# Altium schematic sheet K64.SchDoc
size A3
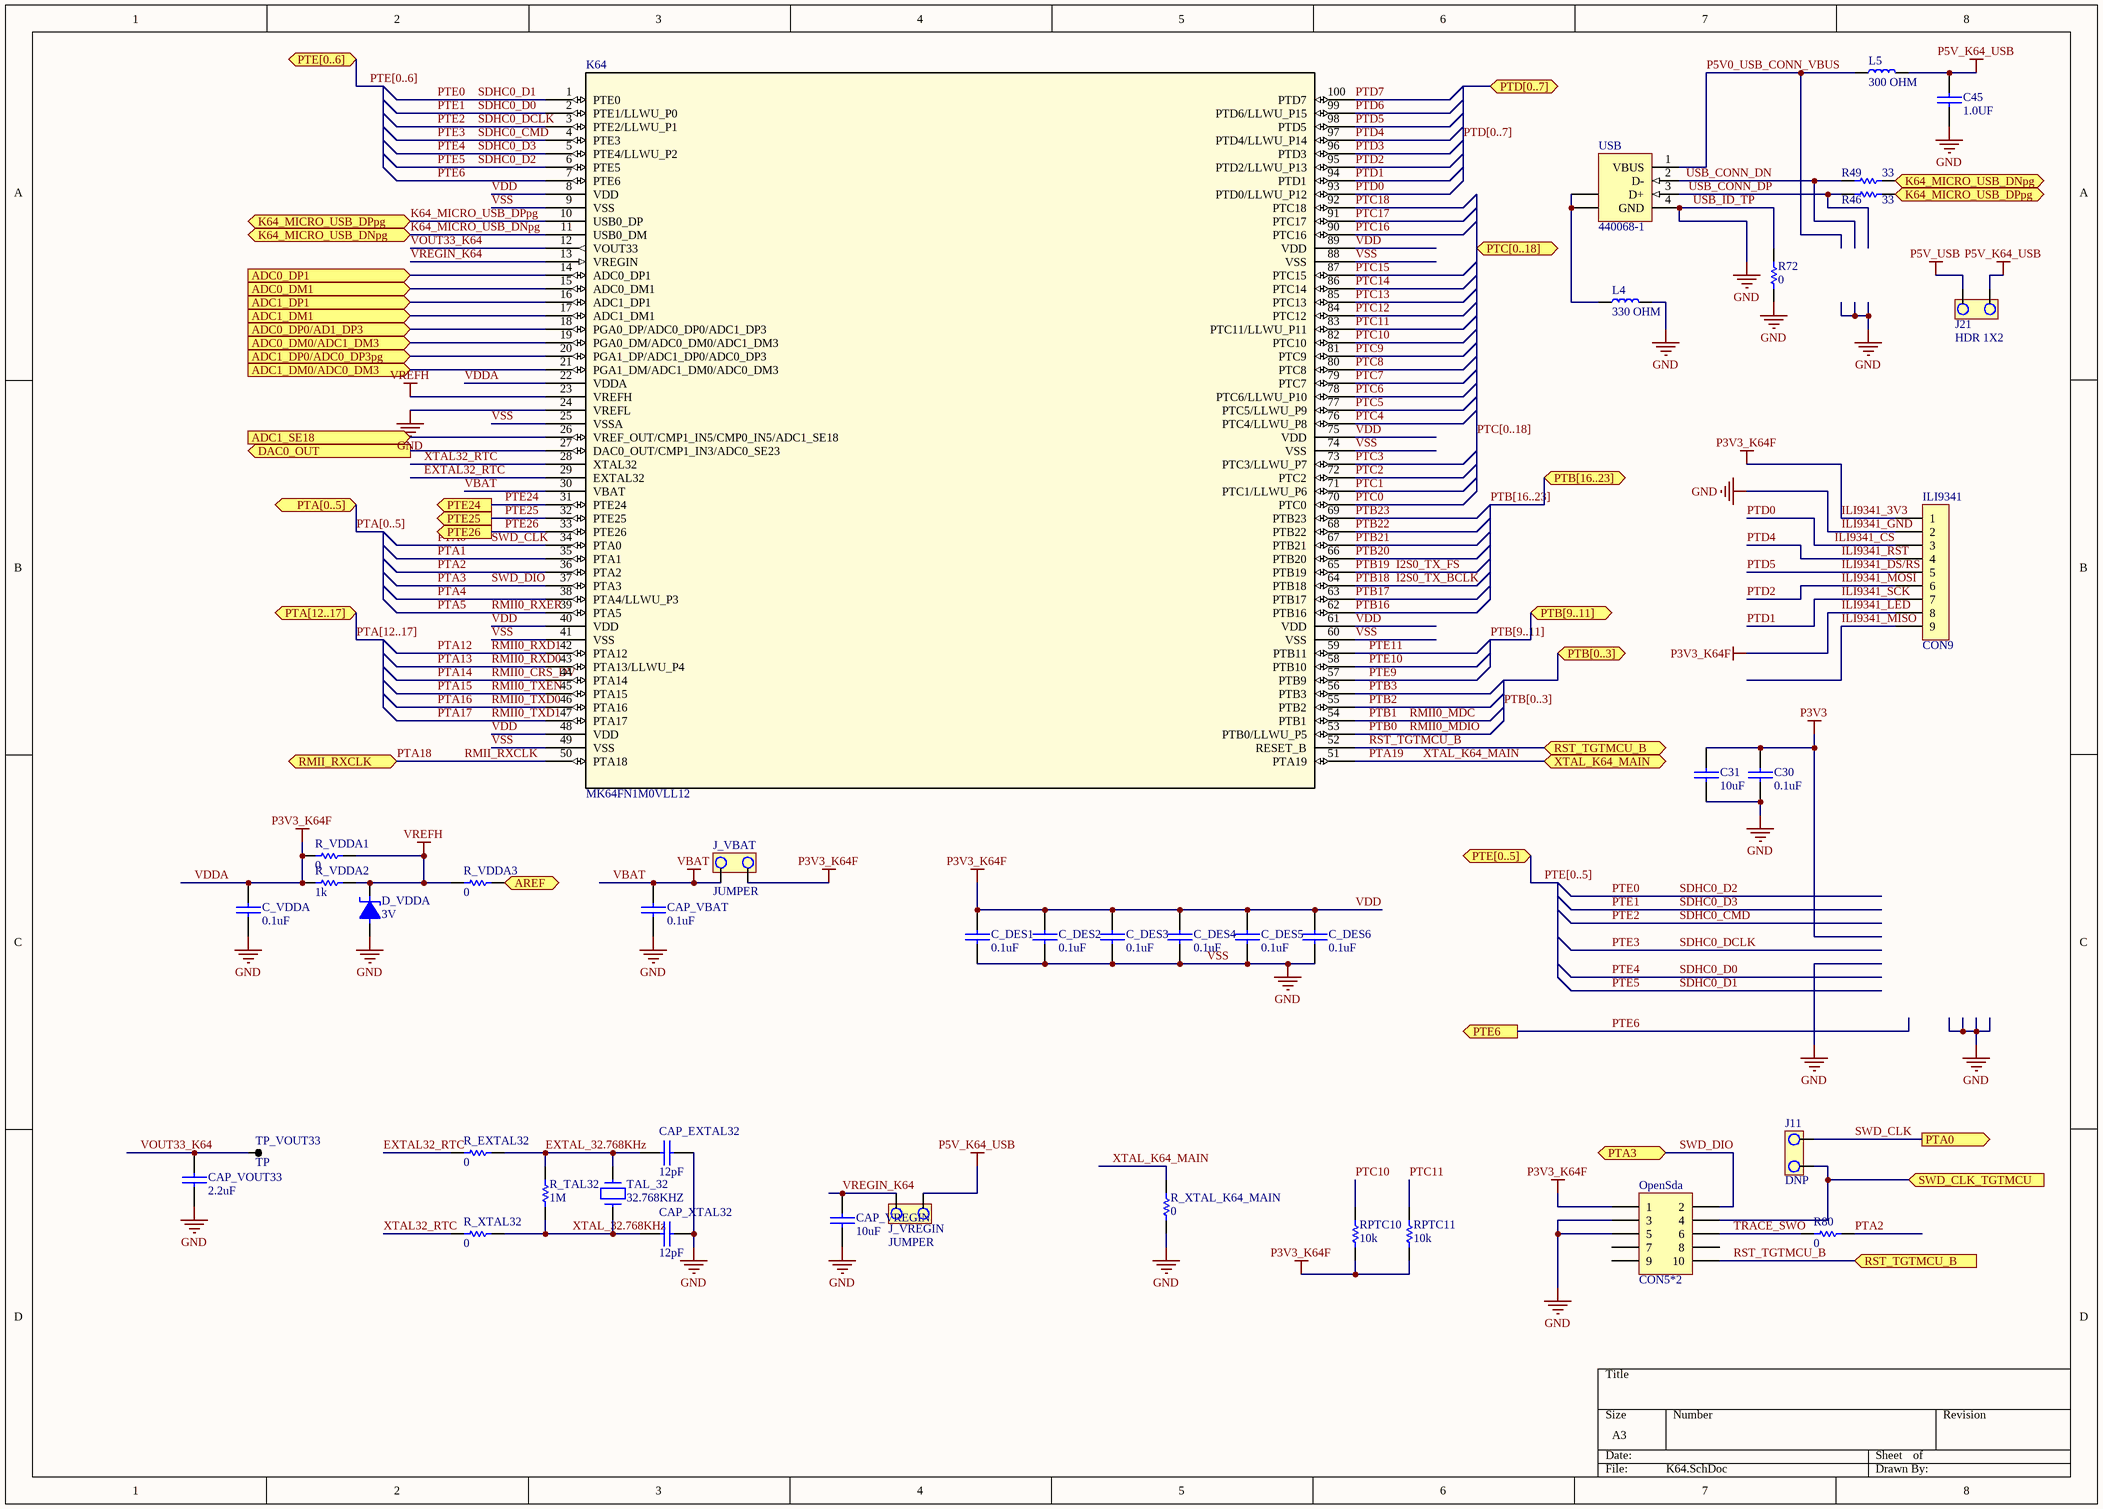
[diagram p0: K64.SchDoc]

## Parts
C30  0.1uF  [0805]
C31  10uF  [CAP200]
C45  1.0UF  [0805]
C_DES1  0.1uF  [0805]
C_DES2  0.1uF  [0805]
C_DES3  0.1uF  [0805]
C_DES4  0.1uF  [0805]
C_DES5  0.1uF  [0805]
C_DES6  0.1uF  [0805]
C_VDDA  0.1uF  [0805]
CAP_EXTAL32  12pF  [0805]
CAP_VBAT  0.1uF  [0805]
CAP_VOUT33  2.2uF  [0805]
CAP_VREGIN  10uF  [0805]
CAP_XTAL32  12pF  [0805]
D_VDDA  3V  [DO41]
ILI9341  CON9  [SIP9]
J11  DNP  [JUMPER2]
J21  HDR 1X2  [JUMPER2]
J_VBAT  JUMPER  [JUMPER2]
J_VREGIN  JUMPER  [JUMPER2]
K64  MK64FN1M0VLL12  [LQFP-144_20X20X1]
L4  330 OHM  [INDUCTOR_FM]
L5  300 OHM  [INDUCTOR_FM]
OpenSda  CON5*2  [SIP5*2]
R46  33  [0805]
R49  33  [0805]
R72  0  [0805]
R80  0  [0805]
R_EXTAL32  0  [0805]
R_TAL32  1M  [0805]
R_VDDA1  0  [0805]
R_VDDA2  1k  [0805]
R_VDDA3  0  [0805]
R_XTAL32  0  [0805]
R_XTAL_K64_MAIN  0  [0805]
RPTC10  10k  [0805]
RPTC11  10k  [0805]
TAL_32  32.768KHZ  [CRISTAL PERFIL]
TP_VOUT33  TP  [TPTH]
USB  440068-1  [440068]

## Ports
ADC0_DM0/ADC1_DM3 (in), ADC0_DM1 (in), ADC0_DP0/AD1_DP3 (in), ADC0_DP1 (in), ADC1_DM0/ADC0_DM3 (in), ADC1_DM1 (in), ADC1_DP0/ADC0_DP3pg (in), ADC1_DP1 (in), ADC1_SE18 (in), AREF (bidir), DAC0_OUT (out), K64_MICRO_USB_DNpg (bidir), K64_MICRO_USB_DPpg (bidir), PTA0 (out), PTA3 (bidir), PTA[0..5] (bidir), PTA[12..17] (bidir), PTB[0..3] (bidir), PTB[9..11] (bidir), PTB[16..23] (bidir), PTC[0..18] (bidir), PTD[0..7] (bidir), PTE6 (out), PTE24 (out), PTE25 (out), PTE26 (out), PTE[0..5] (bidir), PTE[0..6] (bidir), RMII_RXCLK (bidir), RST_TGTMCU_B (bidir), RST_TGTMCU_B (in), SWD_CLK_TGTMCU (in), XTAL_K64_MAIN (bidir)

## Nets
ILI9341_3V3: C_DES1.1 C_DES2.1 C_DES3.1 C_DES4.1 C_DES5.1 C_DES6.1 C_VDDA.1 ILI9341.1 ILI9341.8 J_VBAT.1 K64.8(VDD) K64.22(VDDA) K64.40(VDD) K64.48(VDD) K64.61(VDD) K64.75(VDD) K64.89(VDD) OpenSda.1 R_VDDA1.1 R_VDDA2.1 RPTC10.1 RPTC11.1  [also labelled ILI9341_LED, P3V3_K64F, VDD, VDDA]
ILI9341_GND: C30.2 C31.2 C45.2 C_DES1.2 C_DES2.2 C_DES3.2 C_DES4.2 C_DES5.2 C_DES6.2 C_VDDA.2 CAP_EXTAL32.2 CAP_VBAT.2 CAP_VOUT33.2 CAP_VREGIN.2 CAP_XTAL32.2 D_VDDA.1 ILI9341.2 K64.9(VSS) K64.24(VREFL) K64.25(VSSA) K64.41(VSS) K64.49(VSS) K64.60(VSS) K64.74(VSS) K64.88(VSS) L4.2 OpenSda.3 OpenSda.5 R72.1 R72.2 R_XTAL_K64_MAIN.1 USB.4(GND)  [also labelled GND, USB_ID_TP, VSS]
P3V3: C30.1 C31.1
P5V_K64_USB: C45.1 J21.2 J_VREGIN.2 L5.2
P5V_USB: J21.1
VBAT: CAP_VBAT.1 J_VBAT.2 K64.30(VBAT)
VREFH: D_VDDA.2 K64.23(VREFH) R_VDDA1.2 R_VDDA2.2 R_VDDA3.1
ADC0_DM0/ADC1_DM3: K64.19(PGA0_DM/ADC0_DM0/ADC1_DM3) ; port ADC0_DM0/ADC1_DM3
ADC0_DM1: K64.15(ADC0_DM1) ; port ADC0_DM1
ADC0_DP0/AD1_DP3: K64.18(PGA0_DP/ADC0_DP0/ADC1_DP3) ; port ADC0_DP0/AD1_DP3
ADC0_DP1: K64.14(ADC0_DP1) ; port ADC0_DP1
ADC1_DM0/ADC0_DM3: K64.21(PGA1_DM/ADC1_DM0/ADC0_DM3) ; port ADC1_DM0/ADC0_DM3
ADC1_DM1: K64.17(ADC1_DM1) ; port ADC1_DM1
ADC1_DP0/ADC0_DP3pg: K64.20(PGA1_DP/ADC1_DP0/ADC0_DP3) ; port ADC1_DP0/ADC0_DP3pg
ADC1_DP1: K64.16(ADC1_DP1) ; port ADC1_DP1
ADC1_SE18: K64.26(VREF_OUT/CMP1_IN5/CMP0_IN5/ADC1_SE18) ; port ADC1_SE18
AREF: R_VDDA3.2 ; port AREF
DAC0_OUT: K64.27(DAC0_OUT/CMP1_IN3/ADC0_SE23) ; port DAC0_OUT
EXTAL32_RTC: K64.29(EXTAL32) R_EXTAL32.1
EXTAL_32.768KHz: CAP_EXTAL32.1 R_EXTAL32.2 R_TAL32.2 TAL_32.2
I2S0_TX_BCLK: K64.64(PTB18)  [also labelled PTB18]
I2S0_TX_FS: K64.65(PTB19)  [also labelled PTB19]
ILI9341_CS: ILI9341.3 K64.93(PTD0/LLWU_P12)  [also labelled PTD0]
ILI9341_DS/RS: ILI9341.5 K64.98(PTD5)  [also labelled PTD5]
ILI9341_MISO: ILI9341.9
ILI9341_MOSI: ILI9341.6 K64.95(PTD2/LLWU_P13)  [also labelled PTD2]
ILI9341_RST: ILI9341.4 K64.97(PTD4/LLWU_P14)  [also labelled PTD4]
ILI9341_SCK: ILI9341.7 K64.94(PTD1)  [also labelled PTD1]
K64_MICRO_USB_DNpg: K64.11(USB0_DM) R49.1 ; port K64_MICRO_USB_DNpg
K64_MICRO_USB_DPpg: K64.10(USB0_DP) R46.1 ; port K64_MICRO_USB_DPpg
P5V0_USB_CONN_VBUS: L5.1 USB.1(VBUS)
PTA0: J11.1 K64.34(PTA0) ; port PTA0  [also labelled SWD_CLK]
PTA1: K64.35(PTA1)
PTA2: K64.36(PTA2) R80.2
PTA3: K64.37(PTA3) OpenSda.2 ; port PTA3  [also labelled SWD_DIO]
PTA4: K64.38(PTA4/LLWU_P3)
PTA5: K64.39(PTA5)  [also labelled RMII0_RXER]
PTA12: K64.42(PTA12)  [also labelled RMII0_RXD1]
PTA13: K64.43(PTA13/LLWU_P4)  [also labelled RMII0_RXD0]
PTA14: K64.44(PTA14)  [also labelled RMII0_CRS_DV]
PTA15: K64.45(PTA15)  [also labelled RMII0_TXEN]
PTA16: K64.46(PTA16)  [also labelled RMII0_TXD0]
PTA17: K64.47(PTA17)  [also labelled RMII0_TXD1]
PTA18: K64.50(PTA18) ; port RMII_RXCLK  [also labelled RMII_RXCLK]
PTA19: K64.51(PTA19) R_XTAL_K64_MAIN.2 ; port XTAL_K64_MAIN  [also labelled XTAL_K64_MAIN]
PTB0: K64.53(PTB0/LLWU_P5)  [also labelled RMII0_MDIO]
PTB1: K64.54(PTB1)  [also labelled RMII0_MDC]
PTB2: K64.55(PTB2)
PTB3: K64.56(PTB3)
PTB16: K64.62(PTB16)
PTB17: K64.63(PTB17)
PTB20: K64.66(PTB20)
PTB21: K64.67(PTB21)
PTB22: K64.68(PTB22)
PTB23: K64.69(PTB23)
PTC0: K64.70(PTC0)
PTC1: K64.71(PTC1/LLWU_P6)
PTC2: K64.72(PTC2)
PTC3: K64.73(PTC3/LLWU_P7)
PTC4: K64.76(PTC4/LLWU_P8)
PTC5: K64.77(PTC5/LLWU_P9)
PTC6: K64.78(PTC6/LLWU_P10)
PTC7: K64.79(PTC7)
PTC8: K64.80(PTC8)
PTC9: K64.81(PTC9)
PTC10: K64.82(PTC10) RPTC10.2
PTC11: K64.83(PTC11/LLWU_P11) RPTC11.2
PTC12: K64.84(PTC12)
PTC13: K64.85(PTC13)
PTC14: K64.86(PTC14)
PTC15: K64.87(PTC15)
PTC16: K64.90(PTC16)
PTC17: K64.91(PTC17)
PTC18: K64.92(PTC18)
PTD3: K64.96(PTD3)
PTD6: K64.99(PTD6/LLWU_P15)
PTD7: K64.100(PTD7)
PTE0: K64.1(PTE0) K64.6(PTE5)  [also labelled PTE5, SDHC0_D1, SDHC0_D2]
PTE1: K64.2(PTE1/LLWU_P0) K64.5(PTE4/LLWU_P2)  [also labelled PTE4, SDHC0_D0, SDHC0_D3]
PTE2: K64.3(PTE2/LLWU_P1) K64.4(PTE3)  [also labelled PTE3, SDHC0_CMD, SDHC0_DCLK]
PTE6: K64.7(PTE6) ; port PTE6
PTE9: K64.57(PTB9)
PTE10: K64.58(PTB10)
PTE11: K64.59(PTB11)
PTE24: K64.31(PTE24) ; port PTE24
PTE25: K64.32(PTE25) ; port PTE25
PTE26: K64.33(PTE26) ; port PTE26
RST_TGTMCU_B: K64.52(RESET_B) OpenSda.10 ; port RST_TGTMCU_B
SWD_CLK_TGTMCU: J11.2 OpenSda.4 ; port SWD_CLK_TGTMCU
TRACE_SWO: OpenSda.6 R80.1
USB_CONN_DN: R49.2 USB.2(D-)
USB_CONN_DP: R46.2 USB.3(D+)
VOUT33_K64: CAP_VOUT33.1 K64.12(VOUT33) TP_VOUT33.1
VREGIN_K64: CAP_VREGIN.1 J_VREGIN.1 K64.13(VREGIN)
XTAL32_RTC: K64.28(XTAL32) R_XTAL32.1
XTAL_32.768KHz: CAP_XTAL32.1 R_TAL32.1 R_XTAL32.2 TAL_32.1
NetL4_1: L4.1 USB.5(SHLD) USB.6(SHLD)

Not connected (* = marked no-connect by the designer): OpenSda 7 8 9

## Buses and harness runs
bus PTA[0..5] = port PTA[0..5]
bus PTA[12..17] = port PTA[12..17]
bus PTB[0..3] = port PTB[0..3]
bus PTB[9..11] = port PTB[9..11]
bus PTB[16..23] = port PTB[16..23]
bus PTC[0..18] = port PTC[0..18]
bus PTD[0..7] = port PTD[0..7]
bus PTE[0..5] = port PTE[0..5]
bus PTE[0..6] = port PTE[0..6]

## Library data of the parts
C30 C31 C45 C_DES1-C_DES6 C_VDDA CAP_EXTAL32 CAP_VBAT CAP_VOUT33 CAP_VREGIN CAP_XTAL32 = CAP
D_VDDA = DIODO ZENER
J11 J21 = JUMPER
K64 = MK64FN1M0VLL12: Imported; Vendor: FREESCALE; CPU: ARM Cortex-M4F; Max_Frequency: 120; Flash_KB: 1024; SRAM_KB: 256; Pin_Count: 100; Manufacturer_Part_Number: mk64fn1m0vll12; Package: LQFP; RefDes: RefDes; Type: DEV; Value: Value
L4 L5 = INDUCTOR_1
R46 R49 R72 R80 R_EXTAL32 R_TAL32 R_VDDA1-R_VDDA3 R_XTAL32 R_XTAL_K64_MAIN RPTC10 RPTC11 = RES
TAL_32 = CRISTAL
USB = 440068-1: USB 1.1, Right Angle, Thru-Hole, Reverse Type, Receptacle, 4 Position, Black; ContactMaterial: Copper Alloy; ContactPlating: Gold Flash; TerminationLength: 2.40mm [0.094in.]; PCB_Layout: Complies with manufacturer's recommendation.; DrillSize: Corresponds to nominal value.; PanelGround: Without; Published: 15-Jul-2004; DatasheetDocument: 18-Mar-2004; PackageDocument: 18-Mar-2004; PackageReference: 440068; Publisher: Altium Limited; HousingMaterial: Glass-Filled Thermoplastic; ComponentLink1Description: Manufacturer Link; ComponentLink1URL: http://www.tycoelectronics.com/; ComponentLink2Description: Packaging Specification; ComponentLink2URL: http://ecommas.tycoelectronics.com/commerce/DocumentDelivery/DDEController?Action=showdoc&DocId=Customer+Drawing%7F440068%7FD%7Ftif%7FEnglish%7FC_440068_D.tif